# EasyEDA Pro project 二版平衡车pcb.epro, schematic STM32F1-HC05-board
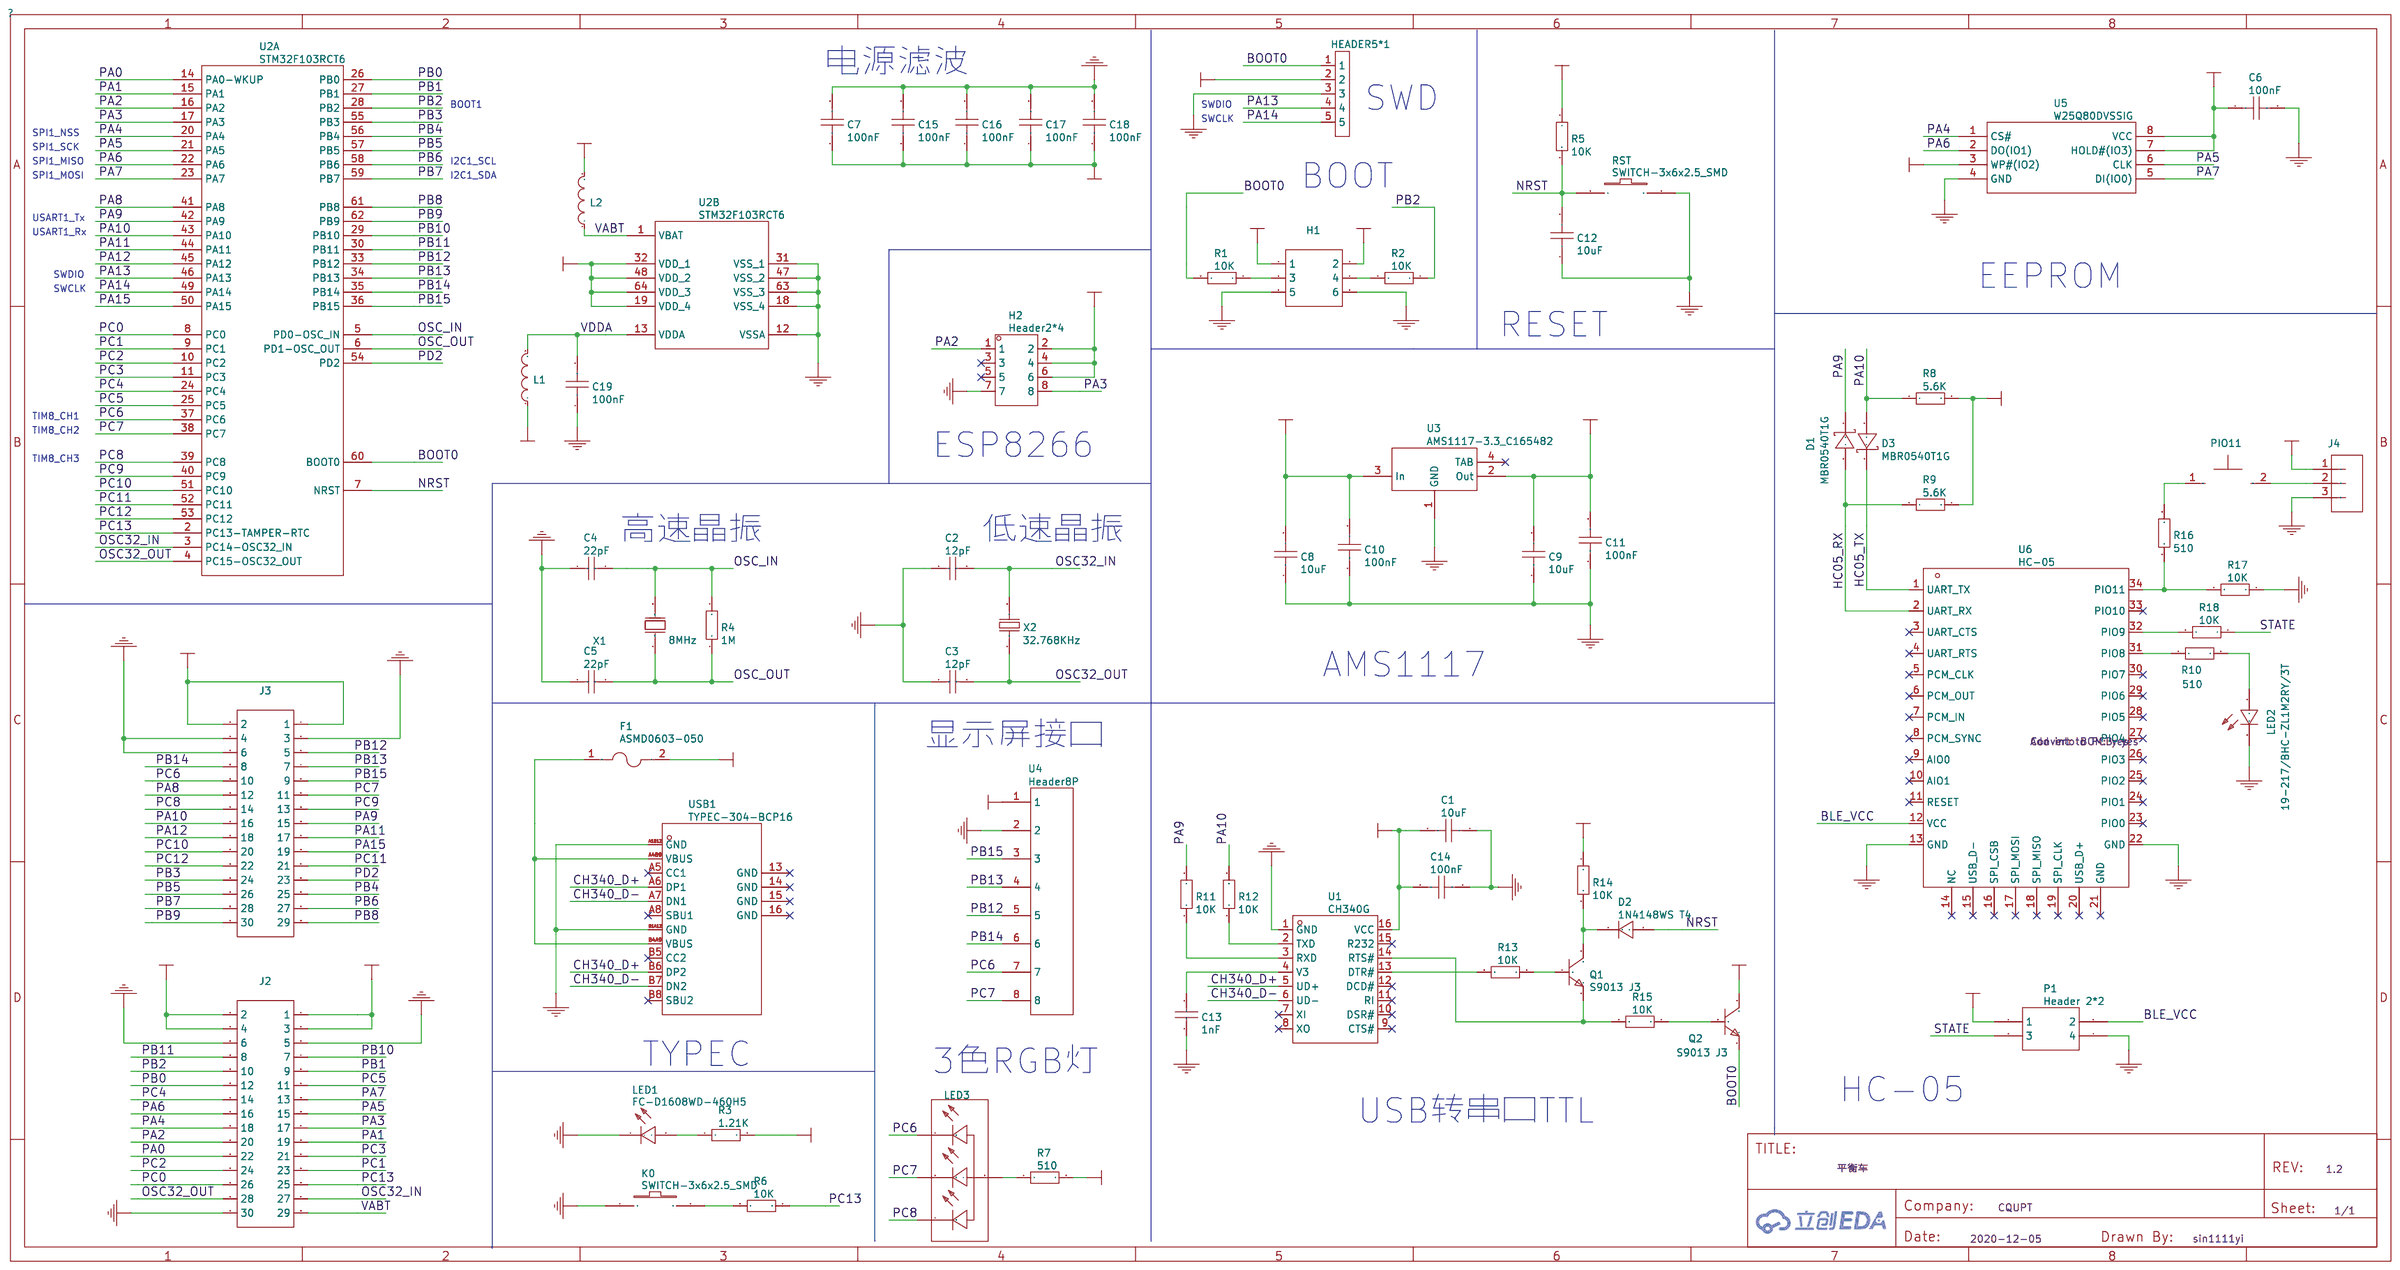
[diagram p3: schematic sheet]

## Parts
1  HEADER5*1
C1  10uF
C2  12pF
C3  12pF
C4  22pF
C5  22pF
C6  100nF
C7  100nF
C8  10uF
C9  10uF
C10  100nF
C11  100nF
C12  10uF
C13  1nF
C14  100nF
C15  100nF
C16  100nF
C17  100nF
C18  100nF
C19  100nF
D1  MBR0540T1G
D2  1N4148WS T4
D3  MBR0540T1G
F1  ASMD0603-050
H1  2.54排母2.54_2x3
H2  Header2*4
J2  Header-Male-2.54_2x15
J3  Header-Male-2.54_2x15
J4  HEADER1*3
K0  SWITCH-3x6x2.5_SMD
L1  SCBG160808U070T
L2  SCBG160808U070T
LED1  FC-D1608WD-460H5
LED2  19-217/BHC-ZL1M2RY/3T
LED3  19-237/R6GHBHC-M07/2T
P1  Header 2*2
PIO11  SKRKAEE020 轻触开关3*4*2
Q1  S9013 J3
Q2  S9013 J3
R1  10K
R2  10K
R3  1.21K
R4  1M
R5  10K
R6  10K
R7  510
R8  5.6K
R9  5.6K
R10  510
R11  10K
R12  10K
R13  10K
R14  10K
R15  10K
R16  510
R17  10K
R18  10K
RST  SWITCH-3x6x2.5_SMD
U1  CH340G
U2  STM32F103RCT6  (sections 1,2)
U3  AMS1117-3.3_C165482
U4  Header8P
U5  W25Q80DVSSIG
U6  HC-05
USB1  TYPEC-304-BCP16
X1  8MHz
X2  32.768KHz

## Library data of the parts
1 = HEADER5*1: Supplier: why
C1 C8 C9 C12 = 10uF: Supplier: LCSC; Manufacturer: SAMSUNG; Manufacturer Part: CL10A106MA8NRNC; Supplier Part: C96446; JLCPCB Part Class: Extend; JLCPCB SMD: Yes
C2 C3 = 12pF: Supplier: LCSC; Manufacturer Part: CL10C120JB8NNNC; Manufacturer: SAMSUNG; Supplier Part: C38523; JLCPCB Part Class: Basic; JLCPCB SMD: Yes
C4 C5 = 22pF: Supplier: LCSC; Manufacturer Part: CL10C220JB8NNNC; Manufacturer: SAMSUNG; Supplier Part: C1653; JLCPCB Part Class: Basic; JLCPCB SMD: Yes
C6 C7 C10 C11 C14-C19 = 100nF: Supplier: LCSC; Manufacturer: YAGEO; Manufacturer Part: CC0603KRX7R9BB104; Supplier Part: C14663; JLCPCB Part Class: Basic; JLCPCB SMD: Yes
C13 = 1nF: Supplier: LCSC; Manufacturer: SAMSUNG; Manufacturer Part: CL10B102KC8NNNC; Supplier Part: C153291; JLCPCB Part Class: Extend; JLCPCB SMD: Yes
D1 D3 = MBR0540T1G: Supplier: LCSC; Manufacturer: ON; image: //image.lceda.cn/szlcsc/C21353.jpg; Supplier Part: C21353; JLCPCB Part Class: Extend; JLCPCB SMD: Yes
D2 = 1N4148WS T4: Supplier: LCSC; Manufacturer: CJ; image: //image.lceda.cn/szlcsc/C2128.jpg; Supplier Part: C2128; JLCPCB Part Class: Basic; JLCPCB SMD: Yes
F1 = ASMD0603-050: Supplier: LCSC; Manufacturer: JDTFUSE; Supplier Part: C135323
H1 = 2.54排母2.54_2x3: Supplier: LCSC; Manufacturer: CONNFLY; Manufacturer Part: DS1023-2*3SF11; Supplier Part: C92272
H2 = Header2*4
J2 J3 = Header-Male-2.54_2x15: Supplier: LCSC; Manufacturer: BOOMELE; Manufacturer Part: 2.54-2*15PDouble Rows; image: //image.lceda.cn/szlcsc/C56496.jpg; Supplier Part: C56496
J4 = HEADER1*3
K0 RST = SWITCH-3x6x2.5_SMD: Supplier Part: C71857; Supplier: LCSC; Manufacturer: BBJ
L1 L2 = SCBG160808U070T: Supplier: LCSC; Supplier Part: C480843; Manufacturer: Yanchuang
LED1 = FC-D1608WD-460H5: Supplier: LCSC; Manufacturer: NATIONSTAR; Supplier Part: C84265; JLCPCB Part Class: Extend; JLCPCB SMD: Yes
LED2 = 19-217/BHC-ZL1M2RY/3T: Supplier: LCSC; Manufacturer: EVERLIGHT; image: //image.lceda.cn/szlcsc/C72041.jpg; Supplier Part: C72041; JLCPCB Part Class: Basic; JLCPCB SMD: Yes
LED3 = 19-237/R6GHBHC-M07/2T: Supplier: LCSC; Supplier Part: C264514; Manufacturer: Everlight Elec; JLCPCB Part Class: Extend; JLCPCB SMD: Yes
P1 = Header 2*2: LatestRevisionDate: 17-Jul-2002; LatestRevisionNote: Re-released for DXP Platform.; Publisher: Altium Limited
PIO11 = SKRKAEE020 轻触开关3*4*2: Supplier: LCSC; Manufacturer: ALPS; Manufacturer Part: SKRKAEE020; Supplier Part: C115357
Q1 Q2 = S9013 J3: Supplier: LCSC; Manufacturer: CJ; image: //image.lceda.cn/szlcsc/C6749.jpg; Supplier Part: C6749; JLCPCB Part Class: Basic; JLCPCB SMD: Yes
R1 R2 R5 R6 R11-R15 R17 R18 = 10K: Supplier: LCSC; Supplier Part: C167144; Manufacturer: Uniroyal Elec; Manufacturer Part: 0603WAD1002T5E; JLCPCB Part Class: Extend; JLCPCB SMD: Yes
R3 = 1.21K: Supplier: LCSC; Manufacturer: UniOhm; Manufacturer Part: 0603WAF1211T5E; Supplier Part: C22835; JLCPCB Part Class: Extend; JLCPCB SMD: Yes
R4 = 1M: Supplier: LCSC; Supplier Part: C185077; Manufacturer: Uniroyal Elec; Manufacturer Part: TC0325B1004T5E; JLCPCB Part Class: Extend; JLCPCB SMD: Yes
R7 R10 R16 = 510: Supplier: LCSC; Supplier Part: C192811; Manufacturer: Uniroyal Elec; Manufacturer Part: TC0325F5100T5E; JLCPCB Part Class: Extend; JLCPCB SMD: Yes
R8 R9 = 5.6K: Supplier: LCSC; Supplier Part: C83629; Manufacturer: Uniroyal Elec; Manufacturer Part: TC0325B5601T5E; JLCPCB Part Class: Extend; JLCPCB SMD: Yes
U1 = CH340G: Supplier: LCSC; Manufacturer: WCH; image: //image.lceda.cn/szlcsc/C14267.jpg; Supplier Part: C14267; JLCPCB Part Class: Basic; JLCPCB SMD: Yes
U2 = STM32F103RCT6: Supplier: LCSC; Manufacturer: STMicroelectronics; image: //image.lceda.cn/szlcsc/C8323.jpg; Supplier Part: C8323; JLCPCB Part Class: Basic
U3 = AMS1117-3.3_C165482: Supplier: LCSC; Supplier Part: C165482; Manufacturer: SK; Manufacturer Part: AMS1117-3.3; JLCPCB Part Class: Extend; JLCPCB SMD: Yes
U4 = Header8P
U5 = W25Q80DVSSIG: Supplier: LCSC; Manufacturer: WINBOND; image: //image.lceda.cn/szlcsc/C14086.jpg; Supplier Part: C14086; JLCPCB Part Class: Extend; JLCPCB SMD: Yes
U6 = HC-05
USB1 = TYPEC-304-BCP16: Supplier: LCSC; Supplier Part: C720629; Manufacturer: XUNPU
X1 = 8MHz: Supplier: LCSC; Manufacturer: YXC; Manufacturer Part: X50328MSB2GI; Supplier Part: C115962; JLCPCB Part Class: Basic; JLCPCB SMD: Yes
X2 = 32.768KHz: Supplier: LCSC; Manufacturer Part: Q13FC1350000400; Manufacturer: EPSON; Supplier Part: C32346; JLCPCB Part Class: Basic; JLCPCB SMD: Yes

## Nets
+5V: C1.2 C8.2 C10.2 C14.2 F1.2 J3.1 J3.2 U1.16(VCC) U3.3(In)
GND: 1.3 C1.1 C2.1 C3.1 C4.1 C5.1 C6.2 C7.2 C8.1 C9.1 C10.1 C11.1 C12.1 C13.1 C14.1 C15.2 C16.2 C17.2 C18.2 C19.1 H1.5 H1.6 H2.7 J2.5 J2.6 J2.30 J3.3 J3.4 J3.6 J4.3 K0.1 LED1.1(-) LED2.2(C) P1.4 R17.1 RST.2 U1.1(GND) U2.12(VSSA) U2.18(VSS_4) U2.31(VSS_1) U2.47(VSS_2) U2.63(VSS_3) U3.1(GND) U4.2 U5.4(GND) U6.13(GND) U6.22(GND) USB1.A1B12(GND) USB1.B1A12(GND)
VCC: 1.2 C6.1 C7.1 C9.2 C11.2 C15.1 C16.1 C17.1 C18.1 H1.1 H1.2 H2.2 H2.4 H2.6 J2.1 J2.2 J2.3 J2.4 J4.1 L1.1 L2.2 P1.1 Q2.3(C) R3.2 R5.1 R7.2 R8.2 R9.2 R14.1 U2.19(VDD_4) U2.32(VDD_1) U2.48(VDD_2) U2.64(VDD_3) U3.2(Out) U4.1 U5.3(WP#(IO2)) U5.7(HOLD#(IO3)) U5.8(VCC)
VDDA: C19.2 L1.2 U2.13(VDDA)
BLE_VCC: P1.2 U6.12(VCC)
BOOT0: 1.1 Q2.2(E) R1.2 U2.60(BOOT0)
CH340_D+: U1.5(UD+) USB1.A6(DP1) USB1.B6(DP2)
CH340_D-: U1.6(UD-) USB1.A7(DN1) USB1.B7(DN2)
HC05_RX: D1.2(A) R9.1 U6.2(UART_RX)
HC05_TX: D3.1(K) U6.1(UART_TX)
NRST: C12.2 D2.2(A) R5.2 RST.1 U2.7(NRST)
OSC32_IN: C2.2 J2.27 U2.3(PC14-OSC32_IN) X2.2
OSC32_OUT: C3.2 J2.28 U2.4(PC15-OSC32_OUT) X2.1
OSC_IN: C4.2 R4.2 U2.5(PD0-OSC_IN) X1.2(OSC2)
OSC_OUT: C5.2 R4.1 U2.6(PD1-OSC_OUT) X1.1(OSC1)
PA0: J2.22 U2.14(PA0-WKUP)
PA1: J2.19 U2.15(PA1)
PA2: H2.1 J2.20 U2.16(PA2)
PA3: H2.8 J2.17 U2.17(PA3)
PA4: J2.18 U2.20(PA4) U5.1(CS#)
PA5: J2.15 U2.21(PA5) U5.6(CLK)
PA6: J2.16 U2.22(PA6) U5.2(DO(IO1))
PA7: J2.13 U2.23(PA7) U5.5(DI(IO0))
PA8: J3.12 U2.41(PA8)
PA9: D1.1(K) J3.15 R11.2 U2.42(PA9)
PA10: D3.2(A) J3.16 R8.1 R12.2 U2.43(PA10)
PA11: J3.17 U2.44(PA11)
PA12: J3.18 U2.45(PA12)
PA13: 1.4 U2.46(PA13)
PA14: 1.5 U2.49(PA14)
PA15: J3.19 U2.50(PA15)
PB0: J2.12 U2.26(PB0)
PB1: J2.9 U2.27(PB1)
PB2: J2.10 R2.1 U2.28(PB2)
PB3: J3.24 U2.55(PB3)
PB4: J3.25 U2.56(PB4)
PB5: J3.26 U2.57(PB5)
PB6: J3.27 U2.58(PB6)
PB7: J3.28 U2.59(PB7)
PB8: J3.29 U2.61(PB8)
PB9: J3.30 U2.62(PB9)
PB10: J2.7 U2.29(PB10)
PB11: J2.8 U2.30(PB11)
PB12: J3.5 U2.33(PB12) U4.5
PB13: J3.7 U2.34(PB13) U4.4
PB14: J3.8 U2.35(PB14) U4.6
PB15: J3.9 U2.36(PB15) U4.3
PC0: J2.26 U2.8(PC0)
PC1: J2.23 U2.9(PC1)
PC2: J2.24 U2.10(PC2)
PC3: J2.21 U2.11(PC3)
PC4: J2.14 U2.24(PC4)
PC5: J2.11 U2.25(PC5)
PC6: J3.10 LED3.1(R-) U2.37(PC6) U4.7
PC7: J3.11 LED3.3(G-) U2.38(PC7) U4.8
PC8: J3.14 LED3.4(B-) U2.39(PC8)
PC9: J3.13 U2.40(PC9)
PC10: J3.20 U2.51(PC10)
PC11: J3.21 U2.52(PC11)
PC12: J3.22 U2.53(PC12)
PC13: J2.25 R6.1 U2.2(PC13-TAMPER-RTC)
PD2: J3.23 U2.54(PD2)
STATE: P1.3 R18.1
VABT: J2.29 L2.1 U2.1(VBAT)
Net-(C13-2): C13.2 U1.4(V3)
Net-(D2-1): D2.1(K) Q1.3(C) R14.2
Net-(F1-1): F1.1 USB1.A4B9(VBUS) USB1.B4A9(VBUS)
Net-(H1-3): H1.3 R1.1
Net-(H1-4): H1.4 R2.2
Net-(J4-2): J4.2 PIO11.2
Net-(K0-2): K0.2 R6.2
Net-(LED1-2): LED1.2(+) R3.1
Net-(LED2-1): LED2.1(A) R10.2
Net-(LED3-2): LED3.2(+) R7.1
Net-(PIO11-1): PIO11.1 R16.2
Net-(Q1-1): Q1.1(B) R13.1
Net-(Q1-2): Q1.2(E) R15.1 U1.14(RTS#)
Net-(Q2-1): Q2.1(B) R15.2
Net-(R10-1): R10.1 U6.31(PIO8)
Net-(R11-1): R11.1 U1.3(RXD)
Net-(R12-1): R12.1 U1.2(TXD)
Net-(R13-2): R13.2 U1.13(DTR#)
Net-(R16-1): R16.1 R17.2 U6.34(PIO11)
Net-(R18-2): R18.2 U6.32(PIO9)

Not connected (* = marked no-connect by the designer): H2 3* 5*; U1 7(XI)* 8(XO)* 9(CTS#)* 10(DSR#)* 11(RI)* 12(DCD#)* 15(R232)*; U3 4(TAB)*; U6 3(UART_CTS)* 4(UART_RTS)* 5(PCM_CLK)* 6(PCM_OUT)* 7(PCM_IN)* 8(PCM_SYNC)* 9(AIO0)* 10(AIO1)* 11(RESET)* 14(NC)* 15(USB_D-)* 16(SPI_CSB)* 17(SPI_MOSI)* 18(SPI_MISO)* 19(SPI_CLK)* 20(USB_D+)* 21(GND)* 23(PIO0)* 24(PIO1)* 25(PIO2)* 26(PIO3)* 27(PIO4)* 28(PIO5)* 29(PIO6)* 30(PIO7)* 33(PIO10)*; USB1 13(GND)* 14(GND)* 15(GND)* 16(GND)* A5(CC1)* A8(SBU1)* B5(CC2)* B8(SBU2)*

## Notes on the sheet
- 电源滤波
- BOOT1
- SWCLK
- SWDIO
- SWD
- SPI1_NSS
- SPI1_SCK
- SPI1_MISO
- I2C1_SCL
- SPI1_MOSI
- I2C1_SDA
- BOOT
- USART1_Tx
- USART1_Rx
- SWDIO
- EEPROM
- SWCLK
- RESET
- TIM8_CH1
- TIM8_CH2
- TIM8_CH3
- ESP8266
- 高速晶振
- 低速晶振
- AMS1117
- 显示屏接口
- TYPEC
- 3色RGB灯
- HC-05
- USB转串口TTL
